# EAGLE design Guitar Tuner (EAGLE 9.6.2)
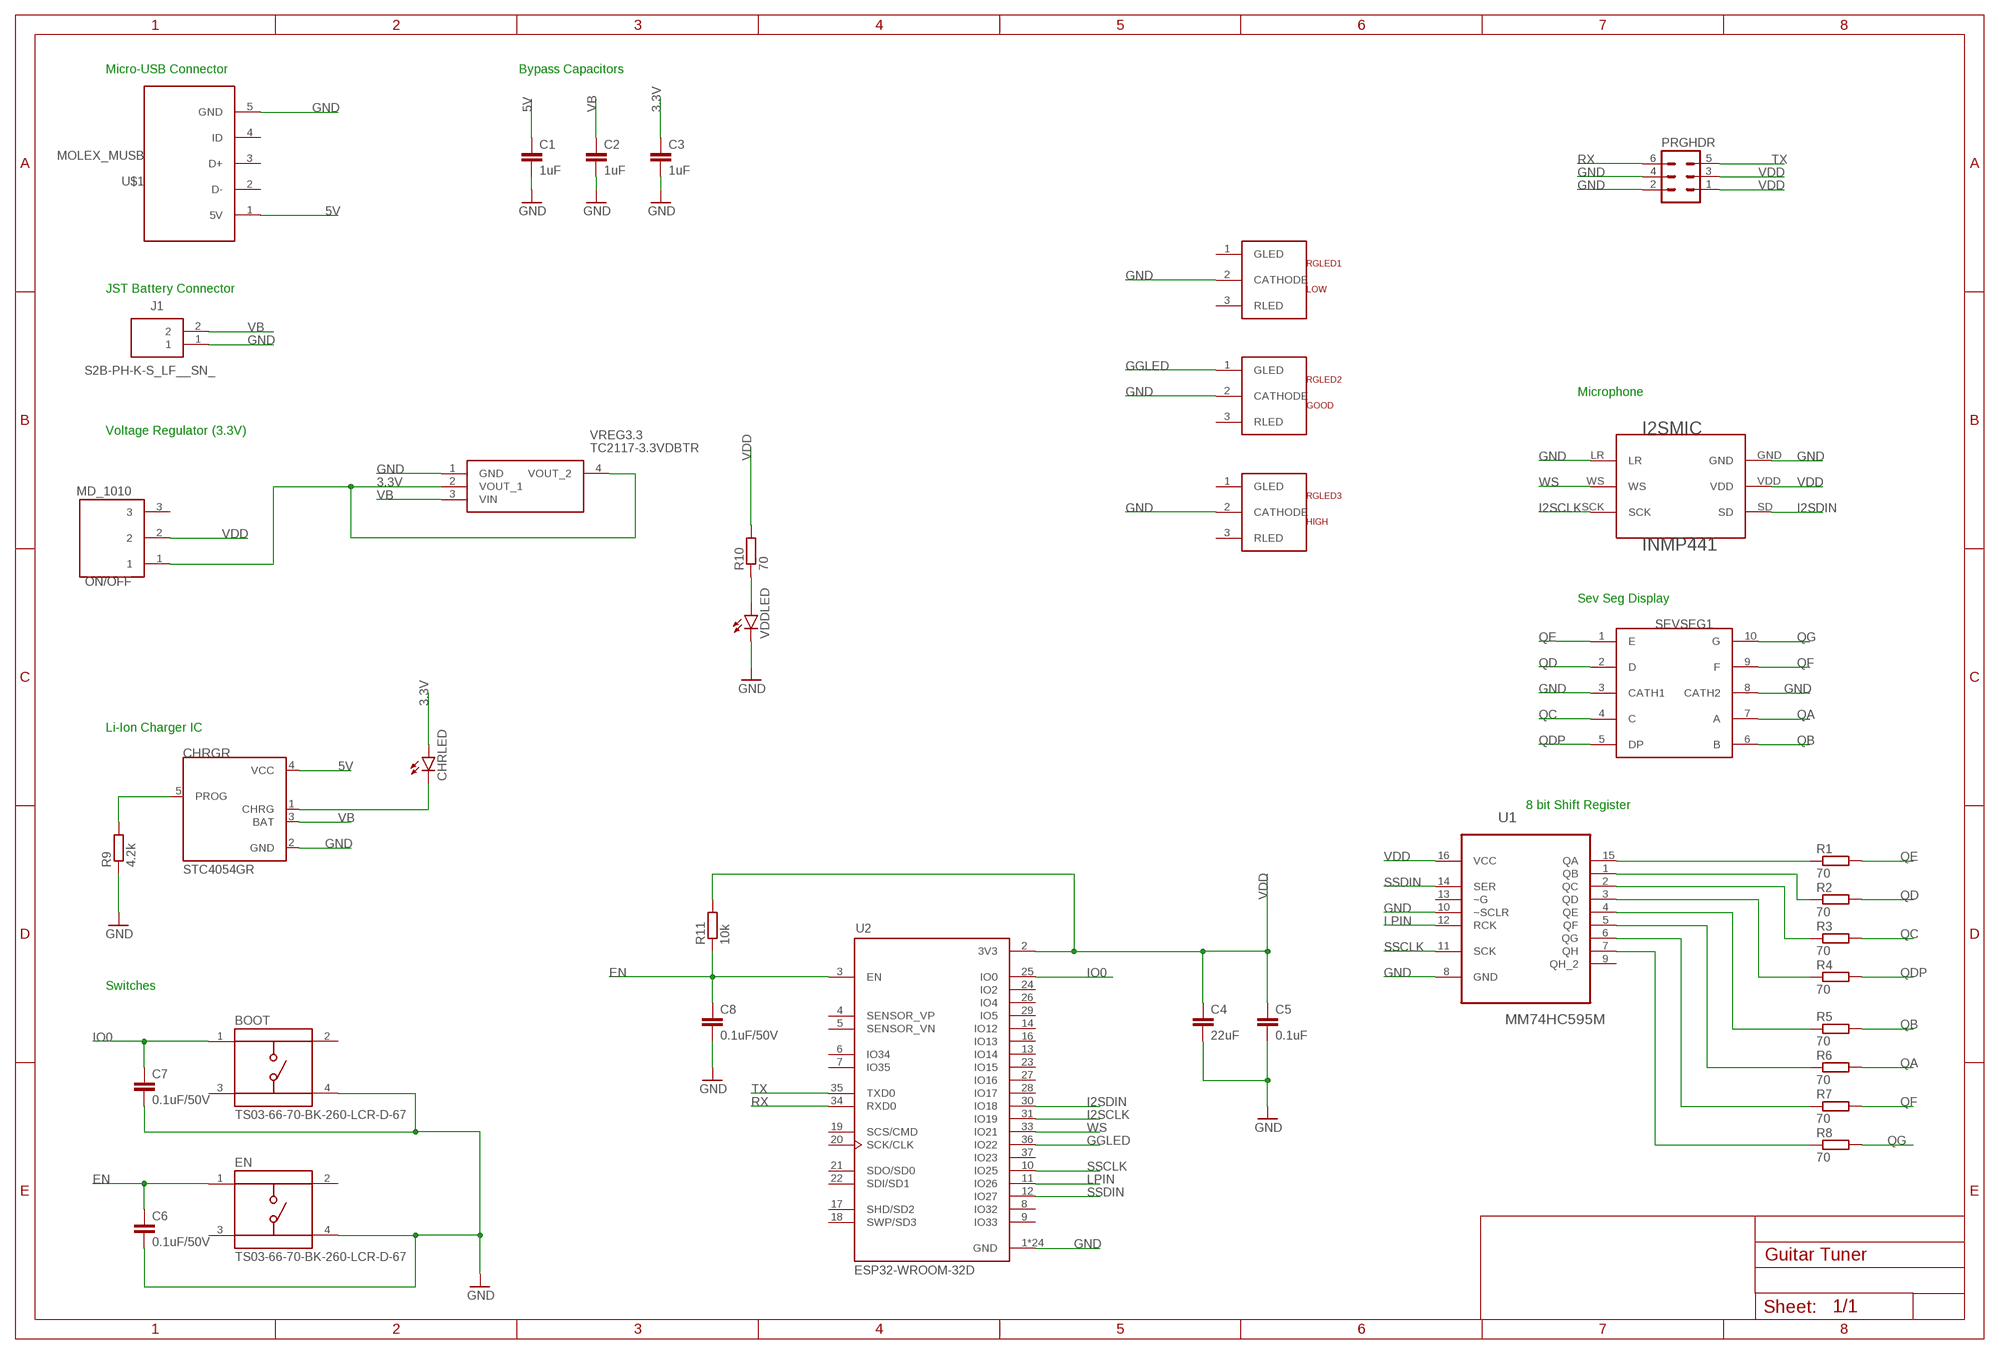
[diagram p0: schematic, sheet 1]

## Parts
BOOT  TS03-66-70-BK-260-LCR-D-67  [SW_TS03-66-70-BK-260-LCR-D-67]
C1  1uF  C-EUC0805  [C0805]
C2  1uF  C-EUC0805  [C0805]
C3  1uF  C-EUC0805  [C0805]
C4  22uF  C-EUC0805  [C0805]
C5  0.1uF  C-EUC0805  [C0805]
C6  0.1uF/50V  C-EUC0805  [C0805]
C7  0.1uF/50V  C-EUC0805  [C0805]
C8  0.1uF/50V  C-EUC0805  [C0805]
CHRGR  STC4054GR  [SOT95P280X110-5N]
CHRLED  LED5MM  [LED5MM]
EN  TS03-66-70-BK-260-LCR-D-67  [SW_TS03-66-70-BK-260-LCR-D-67]
I2SMIC  INMP441  [INMP441]
J1  S2B-PH-K-S_LF__SN_  [SHDRRA2W50P0X200_1X2_590X760X4]
ON/OFF  MD_1010  [MP_1010]
PRGHDR  MA03-2  [MA03-2]
R1  70  R-EU_R0805  [R0805]
R2  70  R-EU_R0805  [R0805]
R3  70  R-EU_R0805  [R0805]
R4  70  R-EU_R0805  [R0805]
R5  70  R-EU_R0805  [R0805]
R6  70  R-EU_R0805  [R0805]
R7  70  R-EU_R0805  [R0805]
R8  70  R-EU_R0805  [R0805]
R9  4.2k  R-EU_R0805  [R0805]
R10  70  R-EU_R0805  [R0805]
R11  10k  R-EU_0207/10  [0207/10]
RGLED1  LOW  HLMP-0800  [HLMP-0800]
RGLED2  GOOD  HLMP-0800  [HLMP-0800]
RGLED3  HIGH  HLMP-0800  [HLMP-0800]
SEVSEG1  LS0803GWK  [LS0803GWK]
U1  MM74HC595M  [SOIC127P600X175-16N]
U2  ESP32-WROOM-32D  [MODULE_ESP32-WROOM-32D]
U$1  MOLEX_MUSB  [MOLEX_MUSB]
VDDLED  LED5MM  [LED5MM]
VREG3.3  TC2117-3.3VDBTR  [SOT230P700X180-4N]

## Nets
3.3V: C3.1 CHRLED.A ON/OFF.1 VREG3.3.2(VOUT_1) VREG3.3.4(VOUT_2)
5V: C1.1 CHRGR.4(VCC) U$1.1(5V)
EN: C6.1 C8.1 EN.1 R11.1 U2.3(EN)
GGLED: RGLED2.1(GLED) U2.36(IO22)
GND: BOOT.4 C1.2 C2.2 C3.2 C4.2 C5.2 C6.2 C7.2 C8.2 CHRGR.2(GND) EN.4 I2SMIC.GND I2SMIC.LR J1.1 PRGHDR.2 PRGHDR.4 R9.1 RGLED1.2(CATHODE) RGLED2.2(CATHODE) RGLED3.2(CATHODE) SEVSEG1.3(CATH1) SEVSEG1.8(CATH2) U1.8(GND) U1.10(~SCLR) U2.1(GND) U2.15(GND) U2.38(GND) U2.39_1(GND) U2.39_2(GND) U2.39_3(GND) U2.39_4(GND) U2.39_5(GND) U2.39_6(GND) U2.39_7(GND) U2.39_8(GND) U2.39_9(GND) U2.39_10(GND) U2.39_11(GND) U2.39_12(GND) U2.39_13(GND) U2.39_14(GND) U2.39_15(GND) U2.39_16(GND) U2.39_17(GND) U2.39_18(GND) U2.39_19(GND) U2.39_20(GND) U2.39_21(GND) U$1.5(GND) VDDLED.K(C) VREG3.3.1(GND)
I2SCLK: I2SMIC.SCK U2.31(IO19)
I2SDIN: I2SMIC.SD U2.30(IO18)
IO0: BOOT.1 C7.1 U2.25(IO0)
LPIN: U1.12(RCK) U2.11(IO26)
N$1: R1.1 U1.15(QA)
N$2: R2.1 U1.1(QB)
N$3: R3.1 U1.2(QC)
N$4: R4.1 U1.3(QD)
N$5: R5.1 U1.4(QE)
N$6: R6.1 U1.5(QF)
N$7: R7.1 U1.6(QG)
N$8: R8.1 U1.7(QH)
N$9: CHRGR.5(PROG) R9.2
N$10: CHRGR.1(CHRG) CHRLED.K(C)
N$12: R10.1 VDDLED.A
QA: R6.2 SEVSEG1.7(A)
QB: R5.2 SEVSEG1.6(B)
QC: R3.2 SEVSEG1.4(C)
QD: R2.2 SEVSEG1.2(D)
QDP: R4.2 SEVSEG1.5(DP)
QE: R1.2 SEVSEG1.1(E)
QF: R7.2 SEVSEG1.9(F)
QG: R8.2 SEVSEG1.10(G)
RX: PRGHDR.6 U2.34(RXD0)
SSCLK: U1.11(SCK) U2.10(IO25)
SSDIN: U1.14(SER) U2.12(IO27)
TX: PRGHDR.5 U2.35(TXD0)
VB: C2.1 CHRGR.3(BAT) J1.2 VREG3.3.3(VIN)
VDD: C4.1 C5.1 I2SMIC.VDD ON/OFF.2 PRGHDR.1 PRGHDR.3 R10.2 R11.2 U1.16(VCC) U2.2(3V3)
WS: I2SMIC.WS U2.33(IO21)
Unconnected: BOOT.2 BOOT.3 EN.2 EN.3 ON/OFF.3 RGLED1.1(GLED) RGLED1.3(RLED) RGLED2.3(RLED) RGLED3.1(GLED) RGLED3.3(RLED) U1.9(QH_2) U1.13(~G) U2.4(SENSOR_VP) U2.5(SENSOR_VN) U2.6(IO34) U2.7(IO35) U2.8(IO32) U2.9(IO33) U2.13(IO14) U2.14(IO12) U2.16(IO13) U2.17(SHD/SD2) U2.18(SWP/SD3) U2.19(SCS/CMD) U2.20(SCK/CLK) U2.21(SDO/SD0) U2.22(SDI/SD1) U2.23(IO15) U2.24(IO2) U2.26(IO4) U2.27(IO16) U2.28(IO17) U2.29(IO5) U2.37(IO23) U$1.2(D-) U$1.3(D+) U$1.4(ID)

## Notes on the sheet
- Micro-USB Connector | Bypass Capacitors
- JST Battery Connector
- Microphone
- Voltage Regulator (3.3V)
- Sev Seg Display
- Li-Ion Charger IC
- 8 bit Shift Register
- Switches

## Library data of the parts
BOOT EN = TS03-66-70-BK-260-LCR-D-67:TS03-66-70-BK-260-LCR-D-67: Check availability <https://pricing.snapeda.com/parts/TS03-66-70-BK-260-LCR-D-67/CUI%20Devices/view-part?ref=eda>; AVAILABILITY: In Stock; CUI_PURCHASE_URL: https://www.cuidevices.com/product/switches/tactile-switches/ts03-series?utm_source=snapeda.com&utm_medium=referral&utm_campaign=snapedaBOM; DESCRIPTION: 6 x 6 mm, 7 mm Actuator Height, 260 gf, Long Crimped, Through Hole, IP67, SPST, Tactile Switch; MF: CUI Devices; MP: TS03-66-70-BK-260-LCR-D-67; PACKAGE: None; PRICE: None; PURCHASE-URL: https://pricing.snapeda.com/search/part/TS03-66-70-BK-260-LCR-D-67/?ref=eda
C1-C8 = rcl:C-EU: CAPACITOR, European symbol; SPICEPREFIX: C
CHRGR = STC4054GR:STC4054GR: STC4054 Series 0.8 A Linear Li-Ion Battery Charger Thermal Regulation -TSOT23-5 Check availability <https://pricing.snapeda.com/parts/STC4054GR/STMicroelectronics/view-part?ref=eda>; AVAILABILITY: In Stock; DESCRIPTION: IC BATT CHG LI-ION 1CEL TSOT23-5; MF: STMicroelectronics; MP: STC4054GR; PACKAGE: TSOT-23 STMicroelectronics; PRICE: None; PURCHASE-URL: https://pricing.snapeda.com/search/part/STC4054GR/?ref=eda
CHRLED VDDLED = led:LED: LED OSRAM: - CHIPLED LG R971, LG N971, LY N971, LG Q971, LY Q971, LO R971, LY R971 LH N974, LH R974 LS Q976, LO Q976, LY Q976 LO Q996 - Hyper CHIPLED LW Q18S LB Q993, LB Q99A, LB R99A - SideLED LS A670, LO A670, LY A670, LG A670, LP A670 LB A673, LV A673, LT A673, LW A673 LH A674 LY A675 LS A676, LA A676, LO A676, LY A676, LW A676 LS A679, LY A679, LG A679 - Hyper Micro SIDELED® LS Y876, LA Y876, LO Y876, LY Y876 LT Y87S - SmartLED LW L88C, LW L88S LB L89C, LB L89S, LG L890 LS L89K, LO L89K, LY L89K LS L896, LA L896, LO L896, LY L896 - TOPLED LS T670, LO T670, LY T670, LG T670, LP T670 LSG T670, LSP T670, LSY T670, LOP T670, LYG T670 LG T671, LOG T671, LSG T671 LB T673, LV T673, LT T673, LW T673 LH T674 LS T676, LA T676, LO T676, LY T676, LB T676, LH T676, LSB T676, LW T676 LB T67C, LV T67C, LT T67C, LS T67K, LO T67K, LY T67K, LW E67C LS E67B, LA E67B, LO E67B, LY E67B, LB E67C, LV E67C, LT E67C LW T67C LS T679, LY T679, LG T679 LS T770, LO T770, LY T770, LG T770, LP T770 LB T773, LV T773, LT T773, LW T773 LH T774 LS E675, LA E675, LY E675, LS T675 LS T776, LA T776, LO T776, LY T776, LB T776 LHGB T686 LT T68C, LB T68C - Hyper Mini TOPLED® LB M676 - Mini TOPLED Santana® LG M470 LS M47K, LO M47K, LY M47K Source: http://www.osram.convergy.de LUXEON: - LUMILED® LXK2-PW12-R00, LXK2-PW12-S00, LXK2-PW14-U00, LXK2-PW14-V00 LXK2-PM12-R00, LXK2-PM12-S00, LXK2-PM14-U00 LXK2-PE12-Q00, LXK2-PE12-R00, LXK2-PE12-S00, LXK2-PE14-T00, LXK2-PE14-U00 LXK2-PB12-K00, LXK2-PB12-L00, LXK2-PB12-M00, LXK2-PB14-N00, LXK2-PB14-P00, LXK2-PB14-Q00 LXK2-PR12-L00, LXK2-PR12-M00, LXK2-PR14-Q00, LXK2-PR14-R00 LXK2-PD12-Q00, LXK2-PD12-R00, LXK2-PD12-S00 LXK2-PH12-R00, LXK2-PH12-S00 LXK2-PL12-P00, LXK2-PL12-Q00, LXK2-PL12-R00 Source: www.luxeon.com KINGBRIGHT: KA-3528ASYC Source: www.kingbright.com
I2SMIC = INMP441:INMP441
J1 = SamacSys_Parts:S2B-PH-K-S_LF__SN_: PH-2.0mm Header side entry 2 way JST PH Series, Series Number S2B, 2mm Pitch 2 Way 1 Row Right Angle PCB Header, Through Hole Termination, 2A Source: Datasheet <http://uk.rs-online.com/web/p/products/8201494>; ARROW_PART_NUMBER: S2B-PH-K-S(LF)(SN); ARROW_PRICE-STOCK: https://www.arrow.com/en/products/s2b-ph-k-s-lf-sn/jst-manufacturing; DESCRIPTION: PH-2.0mm Header side entry 2 way JST PH Series, Series Number S2B, 2mm Pitch 2 Way 1 Row Right Angle PCB Header, Through Hole Termination, 2A; HEIGHT: 4.8mm; MANUFACTURER_NAME: JST (JAPAN SOLDERLESS TERMINALS); MANUFACTURER_PART_NUMBER: S2B-PH-K-S(LF)(SN)
ON/OFF = MP_1010:MD_1010
PRGHDR = con-lstb:MA03-2: PIN HEADER; OC_FARNELL: unknown; OC_NEWARK: unknown
R1-R11 = rcl:R-EU_: RESISTOR, European symbol; SPICEPREFIX: R
RGLED1-RGLED3 = HLMP-0800:HLMP-0800
SEVSEG1 = LS0803GWK:LS0803GWK
U1 = MM74HC595M:MM74HC595M: 8-BIT SHIFT REGISTERS; MPN: MM74HC595M; OC_FARNELL: 1013860; OC_NEWARK: 83K8586; PACKAGE: SOIC-16; SUPPLIER: Fairchild
U2 = ESP32-WROOM-32D:ESP32-WROOM-32D: Bluetooth, WiFi 802.11b/g/n, Bluetooth v4.2 + EDR, Class 1, 2 and 3 Transceiver Module 2.4GHz ~ 2.5GHz Integrated, Trace Surface Mount Check availability <https://pricing.snapeda.com/parts/ESP32-WROOM-32D/Espressif%20Systems/view-part?ref=eda>; AVAILABILITY: In Stock; DESCRIPTION: Bluetooth, WiFi 802.11b/g/n, Bluetooth v4.2 +EDR, Class 1, 2 and 3 Transceiver Module 2.4GHz ~ 2.5GHz Integrated; MF: Espressif Systems; MP: ESP32-WROOM-32D; PACKAGE: Module Espressif Systems; PRICE: None; PURCHASE-URL: https://pricing.snapeda.com/search/part/ESP32-WROOM-32D/?ref=eda
U$1 = MOLEX_MUSB:MOLEX_MUSB
VREG3.3 = TC2117-3.3VDBTR:TC2117-3.3VDBTR: Microchip TC2117-3.3VDBTR, LDO Voltage Regulator, 800mA, 3.3 V +/-0.5%, 2.7 6 Vin, 3-Pin SOT-223 Source: Datasheet <https://componentsearchengine.com/Datasheets/2/TC2117-3.3VDBTR.pdf>; ARROW_PART_NUMBER: TC2117-3.3VDBTR; ARROW_PRICE-STOCK: https://www.arrow.com/en/products/tc2117-3.3vdbtr/microchip-technology?region=nac; DESCRIPTION: Microchip TC2117-3.3VDBTR, LDO Voltage Regulator, 800mA, 3.3 V +/-0.5%, 2.7 6 Vin, 3-Pin SOT-223; HEIGHT: 1.8mm; MANUFACTURER_NAME: Microchip; MANUFACTURER_PART_NUMBER: TC2117-3.3VDBTR; MOUSER_PART_NUMBER: 579-TC2117-3.3VDBTR; MOUSER_PRICE-STOCK: https://www.mouser.co.uk/ProductDetail/Microchip-Technology/TC2117-33VDBTR?qs=AF%252BffTaPb30YsLOBvxArLw%3D%3D

## Board
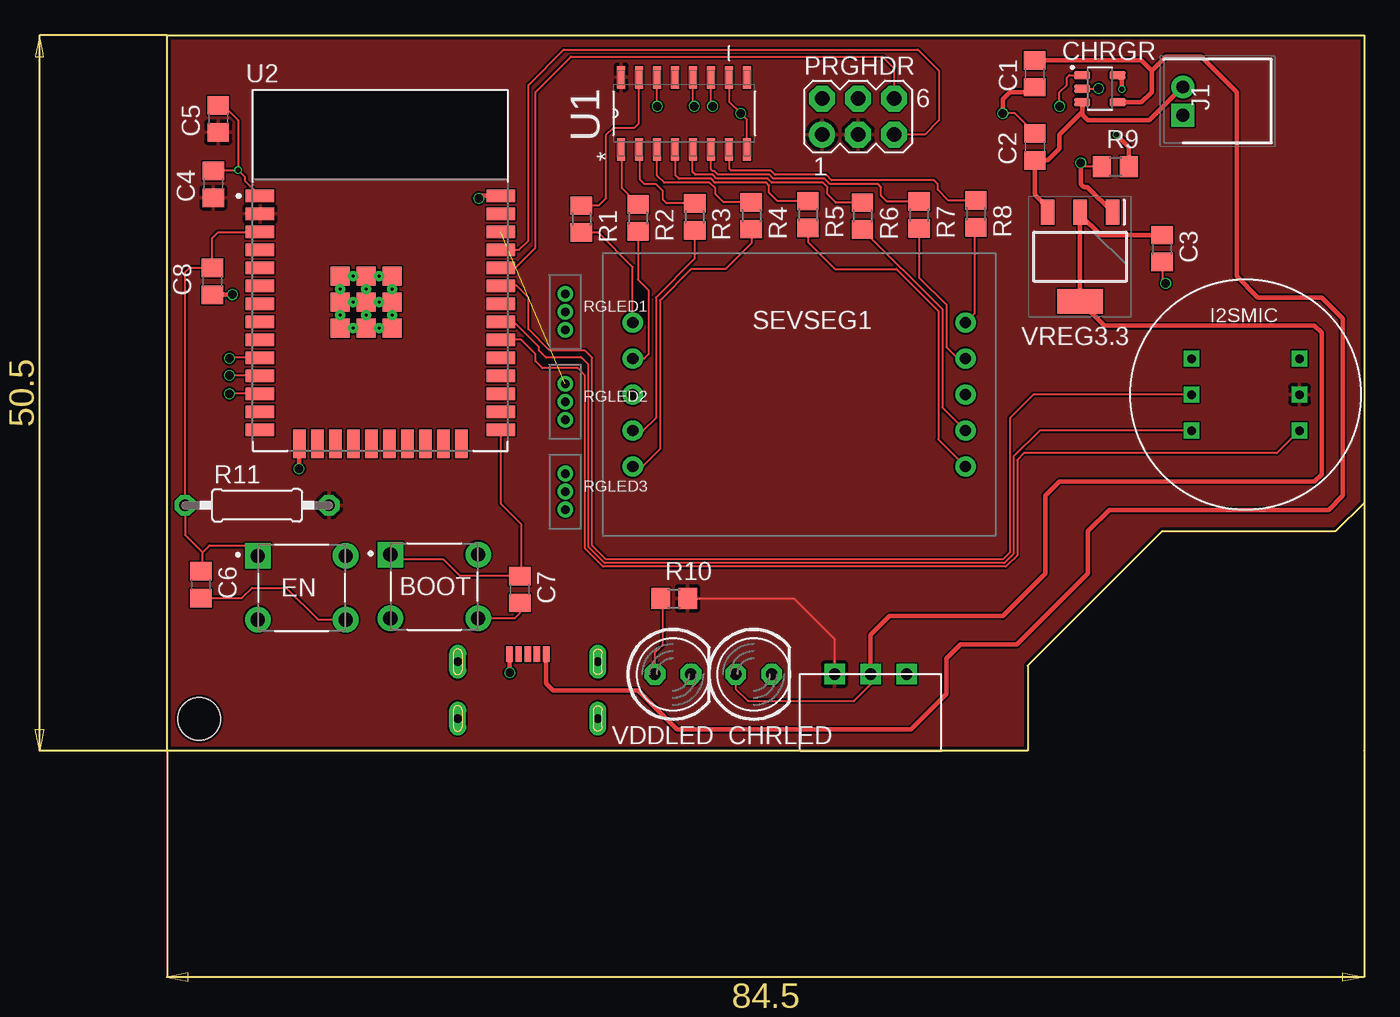
[diagram p1: board, top side]
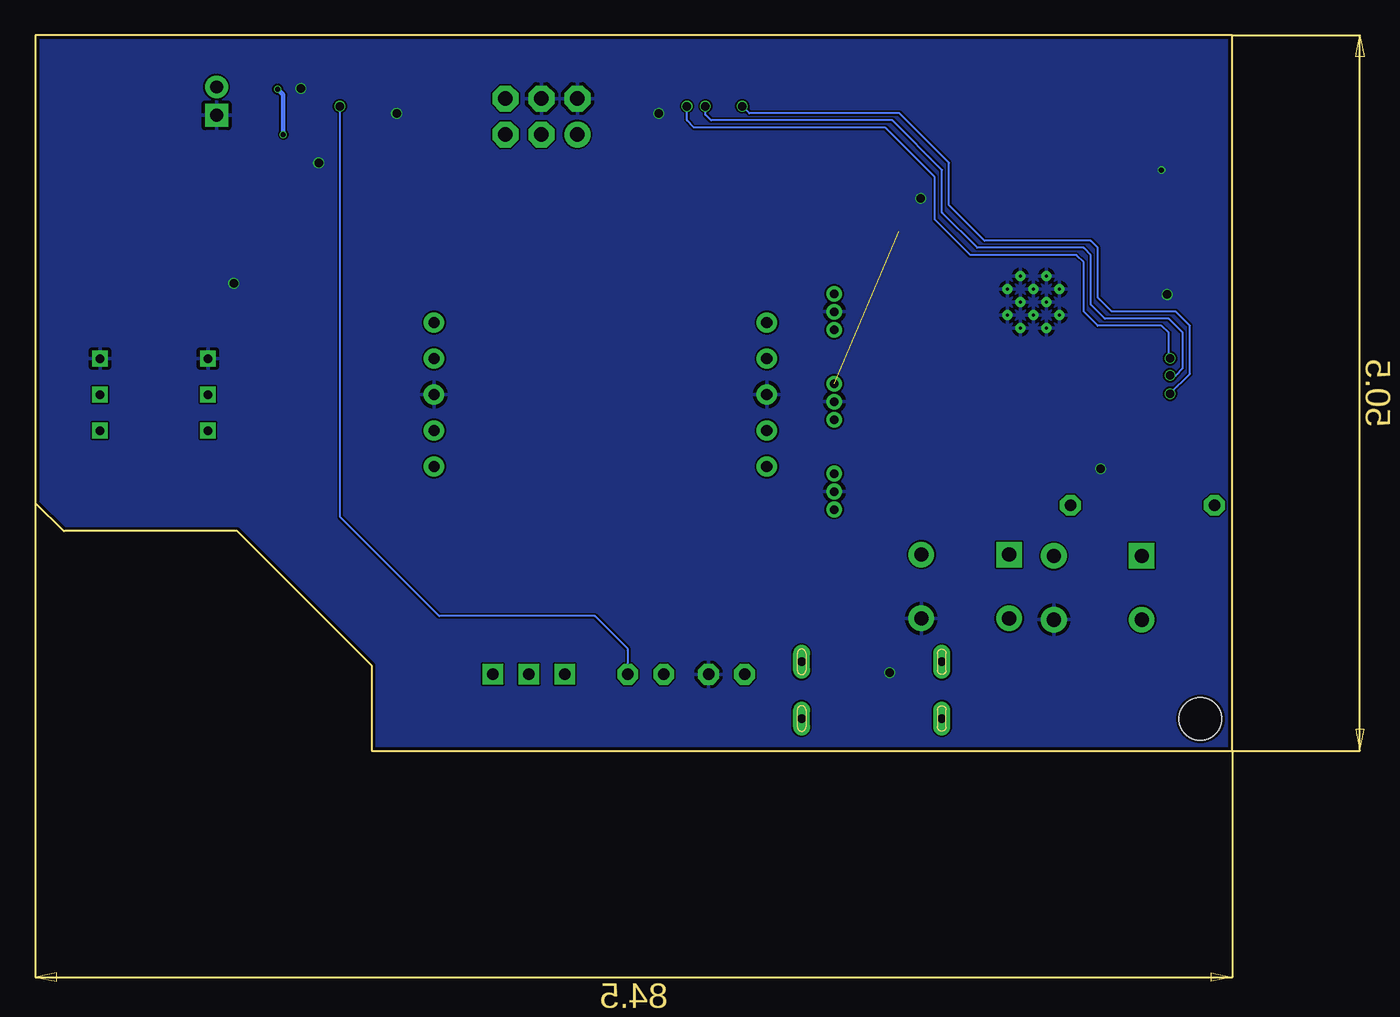
[diagram p2: board, bottom side, seen from below]

Size 84.5 x 50.5 mm. Coordinates in mm from the lower left corner, seen from the top.
Outline: 84.5,17.5 84.5,50.5 0,50.5 0,0 60.75,0 60.75,6 70.25,15.5 82.5,15.5 84.5,17.5
Outline: 84.5,17.5 84.5,0
Copper layers (1*16): Top 0.035mm / dielectric 1.6mm / Bottom 0.035mm
Design rules "jlcpcb-2layers": minimum track width 5mil, minimum drill 0.3mm, track to track 5mil, track to pad 5mil, pad to pad 5mil, via to via 5mil, smd to smd 5mil, copper to edge 0.2mm, drill to drill 6mil, minimum pad ring 10mil, minimum via ring 3mil, stop-mask expansion 4mil, vias tented up to drill 0mil, thermal gap 10mil
Holes 3 mm at 2.25,2.25

### Footprints (pad centres in the part's own frame; a part is rotated, then mirrored left to right if it is on the bottom)
SW_TS03-66-70-BK-260-LCR-D-67 = drill 1 square: 1 -3.1,2.25 | drill 1: 2 3.1,2.25; 3 -3.1,-2.25; 4 3.1,-2.25
C0805 = smd 1.3 x 1.5: 1 -0.95,0; 2 0.95,0
SOT95P280X110-5N = smd 1.14 x 0.59: 1 -1.245,0.95; 2 -1.245,0; 3 -1.245,-0.95; 4 1.245,-0.95; 5 1.245,0.95
LED5MM = drill 0.813 octagon: A -1.27,0; K 1.27,0
INMP441 = drill 0.6 square: GND 3.81,2.54; LR -3.81,2.54; SCK -3.81,-2.54; SD 3.81,-2.54; VDD 3.81,0; WS -3.81,0
SHDRRA2W50P0X200_1X2_590X760X4 = drill 0.9 pad 1.35 square: 1 0,0 | drill 0.9 pad 1.35: 2 -2,0
MP_1010 = drill 0.8 square: 1 -5.4,0; 2 -5.4,-2.54; 3 -5.4,2.54
MA03-2 = drill 1.016: 1 -2.54,-1.27 | drill 1.016 octagon: 2 -2.54,1.27; 3 0,-1.27; 4 0,1.27; 5 2.54,-1.27; 6 2.54,1.27
R0805 = smd 1.3 x 1.5: 1 -0.95,0; 2 0.95,0
0207/10 = drill 0.813 octagon: 1 -5.08,0; 2 5.08,0
HLMP-0800 = drill 0.6: 1 0,1.27; 2 0,0; 3 0,-1.27
LS0803GWK = drill 0.8: 1 -11.75,5.08; 2 -11.75,2.54; 3 -11.75,0; 4 -11.75,-2.54; 5 -11.75,-5.08; 6 11.75,-5.08; 7 11.75,-2.54; 8 11.75,0; 9 11.75,2.54; 10 11.75,5.08
SOIC127P600X175-16N = smd 1.6 x 0.559: 1 -2.54,4.445; 2 -2.54,3.175; 3 -2.54,1.905; 4 -2.54,0.635; 5 -2.54,-0.635; 6 -2.54,-1.905; 7 -2.54,-3.175; 8 -2.54,-4.445; 9 2.54,-4.445; 10 2.54,-3.175; 11 2.54,-1.905; 12 2.54,-0.635; 13 2.54,0.635; 14 2.54,1.905; 15 2.54,3.175; 16 2.54,4.445
MODULE_ESP32-WROOM-32D = smd 2 x 0.9: 1 -8.5,5.26; 2 -8.5,3.99; 3 -8.5,2.72; 4 -8.5,1.45; 5 -8.5,0.18; 6 -8.5,-1.09; 7 -8.5,-2.36; 8 -8.5,-3.63; 9 -8.5,-4.9; 10 -8.5,-6.17; 11 -8.5,-7.44; 12 -8.5,-8.71; 13 -8.5,-9.98; 14 -8.5,-11.25; 25 8.5,-11.25; 26 8.5,-9.98; 27 8.5,-8.71; 28 8.5,-7.44; 29 8.5,-6.17; 30 8.5,-4.9; 31 8.5,-3.63; 32 8.5,-2.36; 33 8.5,-1.09; 34 8.5,0.18; 35 8.5,1.45; 36 8.5,2.72; 37 8.5,3.99; 38 8.5,5.26 | smd 0.9 x 2: 15 -5.715,-12.25; 16 -4.445,-12.25; 17 -3.175,-12.25; 18 -1.905,-12.25; 19 -0.635,-12.25; 20 0.635,-12.25; 21 1.905,-12.25; 22 3.175,-12.25; 23 4.445,-12.25; 24 5.715,-12.25 | smd 1.33 x 1.33: 39_1 -2.835,-0.405; 39_2 -1,-0.405; 39_3 0.835,-0.405; 39_4 -2.835,-2.24; 39_5 -1,-2.24; 39_6 0.835,-2.24; 39_7 -2.835,-4.075; 39_8 -1,-4.075; 39_9 0.835,-4.075 | drill 0.2 pad 0.3: 39_10 -1.917,-0.405; 39_11 -0.083,-0.405; 39_12 -2.835,-1.323; 39_13 -1,-1.323; 39_14 0.835,-1.323; 39_15 -1.917,-2.24; 39_16 -0.083,-2.24; 39_17 -2.835,-3.158; 39_18 -1,-3.158; 39_19 0.835,-3.158; 39_20 -1.917,-4.075; 39_21 -0.083,-4.075
MOLEX_MUSB = smd 0.45 x 1.1: 1 1.3,0; 2 0.65,0; 3 0,0; 4 -0.65,0; 5 -1.3,0 | drill 0.6 pad 1.2 long: P$3 -4.95,-0.55; P$4 -4.95,-4.55; P$7 4.95,-0.55; P$8 4.95,-4.55
SOT230P700X180-4N = smd 1.75 x 0.95: 1 -3.15,2.3; 2 -3.15,0; 3 -3.15,-2.3 | smd 1.75 x 3.2: 4 3.15,0

### Placement (x,y rotation side)
BOOT  18.86,11.59 0 top
C1  61.24,47.79 270 top
C2  61.26,42.63 90 top
C3  70.24,35.45 270 top
C4  3.26,39.99 90 top
C5  3.61,44.61 90 top
C6  2.39,11.72 270 top
C7  24.89,11.38 270 top
C8  3.19,33.14 270 top
CHRGR  65.85,46.74 0 top
CHRLED  41.41,5.39 0 top
EN  9.5,11.5 0 top
I2SMIC  76.13,25.14 0 top
J1  71.71,44.86 270 top
ON/OFF  49.66,0 270 top
PRGHDR  48.78,44.77 0 top
R1  29.24,37.53 270 top
R2  33.24,37.61 270 top
R3  37.24,37.69 270 top
R4  41.24,37.77 270 top
R5  45.24,37.85 270 top
R6  49.09,37.74 270 top
R7  53.09,37.82 270 top
R8  57.09,37.9 270 top
R9  66.94,41.24 0 top
R10  35.79,10.74 0 top
R11  6.35,17.32 0 top
RGLED1  28.1,30.99 0 top
RGLED2  28.1,24.64 0 top
RGLED3  28.1,18.29 0 top
SEVSEG1  44.61,25.14 0 top
U1  36.5,45 90 top
U2  15.05,33.91 0 top
U$1  25.46,6.82 0 top
VDDLED  35.71,5.39 0 top
VREG3.3  64.45,34.87 270 top

### Tracks (layer width: path | path; a pad name or v marks a point on that pad's centre or on a via)
3.3V
  Top 0.127: CHRLED.A 40.14,4.36 41,3.5 48.5,3.5 49.66,4.66 ON/OFF.1
  Top 0.305: VREG3.3.2 64.45,37.85 | 64.45,37.85 VREG3.3.4 66.17,30 81,30 81.5,29.5 81.5,19.5 81,19 63,19 62,18 62,12.5 59,9.5 51,9.5 49.66,8.16 ON/OFF.1 | C3.1 65.9,36.4 64.45,37.85
5V
  Top 0.305: U$1.1 26.76,4.74 27.25,4.25 33.25,4.25 36,1.5 52.5,1.5 55,4 55,6.5 56,7.5 60,7.5 65,12.5 65,15.5 66.5,17 82,17 83,18 83,30.5 81.5,32 77,32 75.5,33.5 75.5,46.5 73,49 70.5,49 69.5,48 | 69.5,48 69.5,46.5 68.79,45.79 CHRGR.4 | C1.1 68.76,48.74 69.5,48
EN
  Top 0.127: 2.5,14 1.27,15.23 R11.1 1.27,33.77 1.59,34.09 C8.1 3.19,36.19 3.6,36.6 6.4,36.6 6.46,36.54
  Top 0.152: EN.1 5.65,14.5 3,14.5 2.5,14 2.5,12.78 C6.1 | U2.3 6.46,36.54
GGLED  (1 unrouted)
GND  (via drill 0.35, 0.6)
  Top 0.127: C8.2 3.3,32.08 | C6.2 5.27,10.77 6,11.5 8.4,11.5 10.65,9.25 EN.4 | C7.2 24.89,9.69 24.54,9.34 BOOT.4 | U1.8 40.95,44.55 v40.5,45 39.67,45.83 U1.10 | R9.1 64.76,41.24 v64.5,41.5 | C2.2 59.84,45 v59,45 | C3.2 70.24,33.26 v70.5,33 | CHRGR.2 64.61,46.75 v65.75,46.75 | U2.39_20 U2.39_7 U2.39_17 | U2.39_8 U2.39_21 U2.39_9 | U2.39_19 U2.39_6 | U2.39_15 U2.39_4 | U2.39_12 U2.39_1 | U2.39_10 14,33.51 | 14,33.51 U2.39_2 | U2.39_11 U2.39_3 U2.39_14 | U2.39_16 U2.39_5 U2.39_18 | U2.39_13 14,32.64 14,33.51
  Top 0.152: C4.2 3.32,41 v5,41 | U2.1 5.5,40.22 5.5,40.5 v5,41 | C5.2 3.94,45.56 5,44.5 v5,41
  Top 0.305: U$1.5 24.16,5.54 v24.2,5.5 | VREG3.3.1 64.97,39.8 64.7,39.8 64.5,40 v64.5,41.5 | U2.38 22.17,39.17 v22,39 | U2.15 9.34,19.93 v9.3,19.9 | C8.2 v4.59,32.19 v4.6,32.2 | C1.2 60.9,46.5 59.5,46.5 59,46 v59,45
  pour Bottom: 0,50.5 0,0 60.75,0 60.75,6 70.25,15.5 82.5,15.5 84.5,17.5 84.5,50.5
I2SCLK
  Top 0.127: I2SMIC.SCK 61.6,22.6 59.75,20.75 59.75,13.89 59.1,13.25 30.89,13.25 29.75,14.39 29.75,27.25 29.25,27.75 29.2,27.8 | 24.27,30.28 U2.31
  Top 0.152: 29.25,27.75 26.75,27.75 26.25,28.25 26.25,28.5 24.47,30.28 U2.31
I2SDIN
  Top 0.127: I2SMIC.SD 78.34,21 60.5,21 60.01,20.51 60.01,13.79 59.21,12.99 30.79,12.99 29.49,14.29 29.49,26.5 28.99,27 26.5,27 26,27.5 26,28 24.99,29.01 U2.30
IO0
  Top 0.152: U2.25 23.55,17.45 25,16 25,12.44 C7.1 20.67,12.33 19.5,13.5 16.1,13.5 BOOT.1
LPIN  (via drill 0.6)
  Top 0.127: v4.4,26.5 4.43,26.47 U2.11 | v37.2,45.5 37.13,45.56 U1.12
  Bottom 0.127: v4.4,26.5 4,26.5 3.5,27 3.5,29.5 4.5,30.5 9,30.5 10,31.5 10,35 10.5,35.5 18,35.5 20.5,38 20.5,41 24,44.5 36.8,44.5 37.2,44.9 v37.2,45.5
N$1
  Top 0.15: R1.1 29.26,38.5 30.5,38.5 31,39 31,43.5 31.5,44 33,44 33.3,44.3 33.3,47.52
  Top 0.254: 33.3,47.52 U1.15
N$2
  Top 0.15: R2.1 32.1,39.7 32.1,42.3 32,42.41
  Top 0.254: 32,42.41 U1.1
N$3
  Top 0.15: R3.1 35.26,38.64 35,38.9 35,39.5 34.5,40 33.7,40 33.4,40.3 33.4,42.34 33.3,42.44
  Top 0.254: 33.3,42.44 U1.2
N$4
  Top 0.15: R4.1 39.28,38.72 38.7,39.3 38.7,39.7 38.3,40.1 35.1,40.1 34.59,40.6 U1.3
N$5
  Top 0.15: U1.4 35.9,42.42 35.9,40.6 36.12,40.38 38.41,40.38 38.69,40.1 42.3,40.1 42.5,39.9 42.5,39.4 43.1,38.8 R5.1
N$6
  Top 0.15: U1.5 37.1,42.42 37.1,40.85 37.3,40.65 38.53,40.65 38.78,40.4 42.39,40.4 42.69,40.1 46.3,40.1 46.6,39.8 46.6,39.3 47.21,38.69 R6.1
N$7
  Top 0.15: R7.1 50.83,38.77 50.4,39.2 50.4,39.8 50.2,40 46.79,40 46.41,40.38 42.81,40.38 42.51,40.68 38.9,40.68 38.64,40.93 38.5,40.93 38.41,41.03 U1.6
N$8
  Top 0.15: R8.1 55.15,38.85 54.4,39.6 54.4,40 54.12,40.28 46.91,40.28 46.53,40.65 42.92,40.65 42.62,40.95 39.8,40.95 39.7,41.05 39.7,42.44 U1.7
N$9  (via drill 0.35)
  Top 0.305: R9.2 67.89,42.61 v67,43.5 | v67.4,46.7 67.4,47.38 CHRGR.5
  Bottom 0.305: v67,43.5 67,46.3 v67.4,46.7
N$10  (via drill 0.6)
  Top 0.127: v63,45.5 63,46.5 63.5,47 63.5,47.5 63.69,47.69 CHRGR.1
  Bottom 0.127: CHRLED.K 42.68,7.18 45,9.5 56,9.5 63,16.5 v63,45.5
N$12
  Top 0.127: VDDLED.A 34.44,6.94 35,7.5 35,10.58 R10.1
QA
  Top 0.152: R6.2 54.72,31.16 54.72,24.24 SEVSEG1.7
QB
  Top 0.152: R5.2 45.24,35.9 47.14,34 51.48,34 54.44,31.04 54.44,21.98 SEVSEG1.6
QC
  Top 0.152: R3.2 37.24,34.74 34.5,32 34.5,23.5 33.6,22.6 SEVSEG1.4
QD
  Top 0.152: R2.2 33.24,33.26 34,32.5 34,28 33.68,27.68 SEVSEG1.2
QDP
  Top 0.152: R4.2 41.24,35.82 39.42,34 37,34 34.78,31.78 34.78,21.28 33.56,20.06 SEVSEG1.5
QE
  Top 0.152: SEVSEG1.1 32.86,34.14 30.44,36.56 29.26,36.56 R1.2
QF
  Top 0.152: R7.2 53.09,33.41 55,31.5 55,28.5 55.82,27.68 SEVSEG1.9
QG
  Top 0.152: R8.2 57,36.86 57,30.86 SEVSEG1.10
RX
  Top 0.127: U2.34 24.59,34.09 26,35.5 26,46.5 28.5,49 50.5,49 51.32,48.18 PRGHDR.6
SSCLK  (via drill 0.6)
  Top 0.127: v38.5,45.5 38.41,45.59 U1.11 | U2.10 4.44,27.74 v4.4,27.7
  Bottom 0.127: v4.4,27.7 4.5,27.8 4.5,29.5 5,30 9.5,30 10.5,31 10.5,34.5 11,35 18.5,35 21,37.5 21,40.5 24.5,44 38,44 38.5,44.5 v38.5,45.5
SSDIN  (via drill 0.6)
  Top 0.127: U2.12 v4.4,25.2 | v34.6,45.5 v34.59,45.51 U1.14
  Bottom 0.127: v4.4,25.2 3,26.6 3,30 4,31 8.5,31 9.5,32 9.5,35.5 10,36 17.5,36 20,38.5 20,41.5 23.5,45 34.1,45 v34.6,45.5
TX
  Top 0.127: U2.35 24.86,35.36 25.5,36 25.5,47 28,49.5 53,49.5 54.5,48 54.5,44.5 53.5,43.5 PRGHDR.5
VB
  Top 0.305: J1.2 70.8,45.95 70.78,45.95 69.33,44.5 65,44.5 64.61,44.9 CHRGR.3 64.61,45.1 63,43.5 63,42.5 62.18,41.68 C2.1 | 60.94,42 C2.1 | C2.1 61.26,39.24 62.15,38.35 VREG3.3.3
VDD
  Top 0.127: R10.2 44.26,10.74 47.12,7.88 ON/OFF.2
  pour Top: 0,50.5 84.5,50.5 84.5,17.5 82.5,15.5 70.25,15.5 60.75,6 60.75,0 0,0
WS
  Top 0.127: I2SMIC.WS 61.14,25.14 59.5,23.5 59.5,14 59,13.5 31,13.5 30,14.5 30,27.75 29.5,28.25 27,28.25 25.5,29.75 25.5,32 24.68,32.82 U2.33